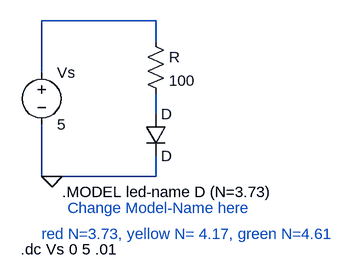
[diagram p0: schematic Versuch2_Lab1.asc]
Versuch2_Lab1.asc, the LTspice schematic file:
Version 4
SHEET 1 1272 680
WIRE 272 -128 96 -128
WIRE 272 -96 272 -128
WIRE 96 -48 96 -128
WIRE 272 16 272 -16
WIRE 96 112 96 32
WIRE 112 112 96 112
WIRE 272 112 272 80
WIRE 272 112 112 112
FLAG 112 112 0
SYMBOL voltage 96 -64 R0
SYMATTR InstName Vs
SYMATTR Value 5
SYMBOL res 256 -112 R0
SYMATTR InstName R
SYMATTR Value 100
SYMBOL diode 256 16 R0
SYMATTR InstName D
TEXT 128 136 Left 2 !.MODEL led-name D (N=3.73)
TEXT 136 160 Left 2 ;Change Model-Name here
TEXT 96 200 Left 2 ;red N=3.73, yellow N= 4.17, green N=4.61
TEXT 64 224 Left 2 !.dc Vs 0 5 .01

The netlist it stands for:
* Versuch2_Lab1.asc
Vs N001 0 5
R N001 N002 100
D N002 0 D
.model D D
.lib standard.dio
.MODEL led-name D (N=3.73)
* Change Model-Name here
* red N=3.73, yellow N= 4.17, green N=4.61
.dc Vs 0 5 .01
.backanno
.end